# EAGLE design V5.8-18-09-27 (EAGLE 7.6.0)
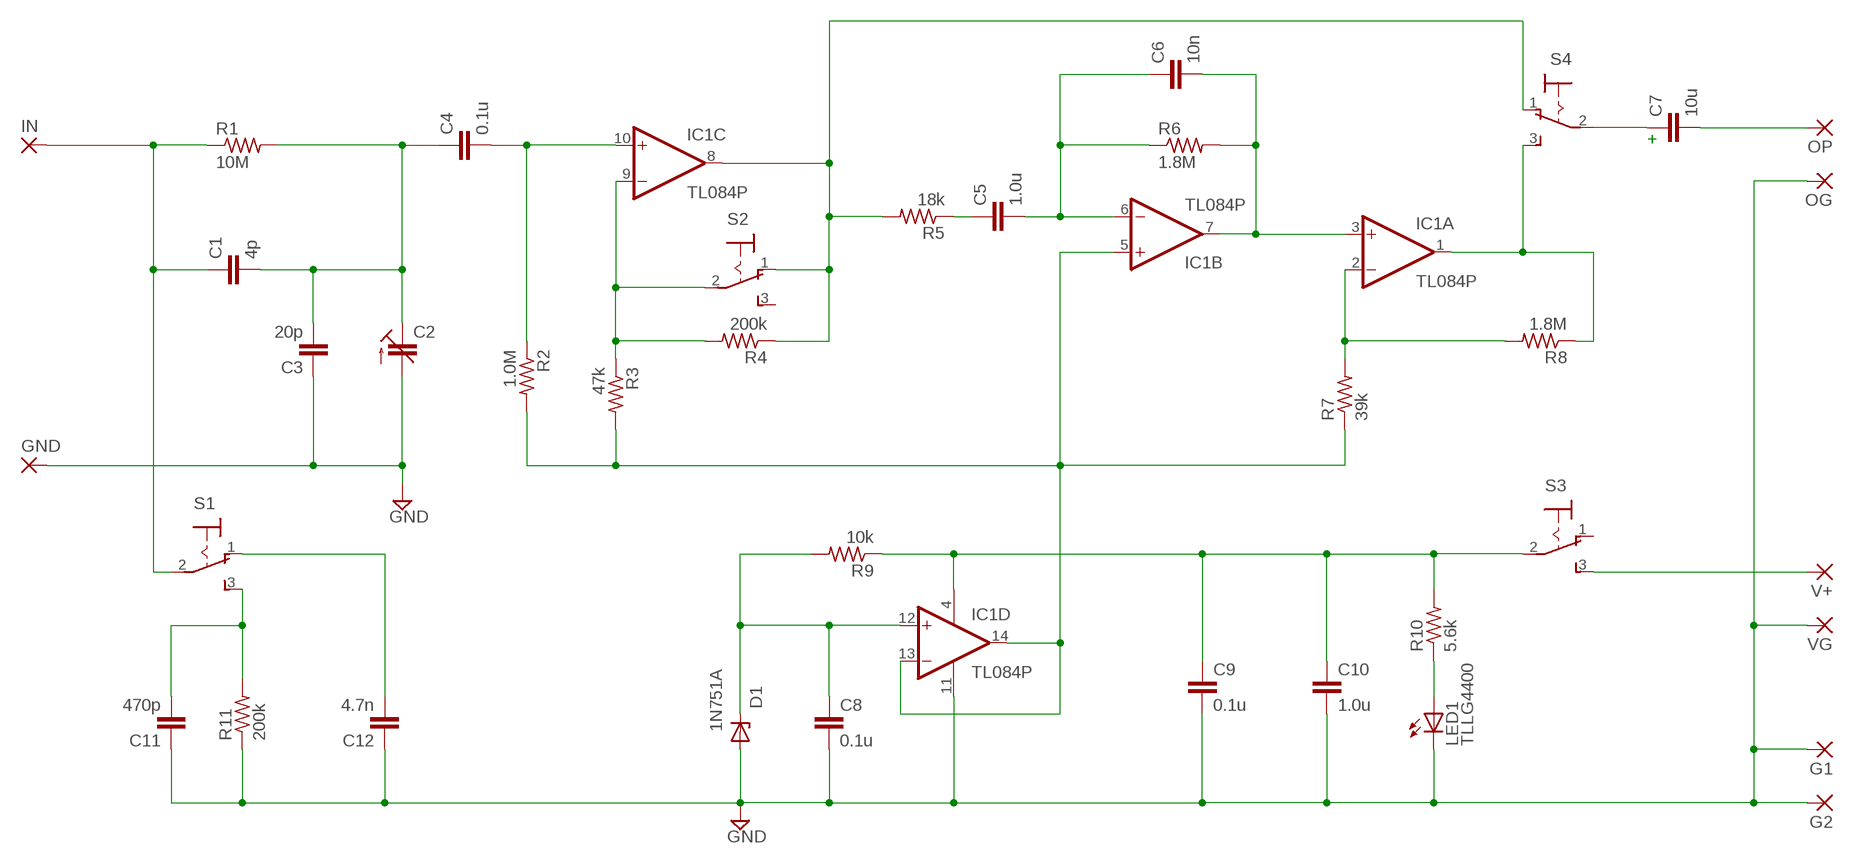
[diagram p0: schematic, sheet 1]

## Parts
C1  4p  C-EU050-024X044  [C050-024X044]
C2  C-TRIMMGKG20015  [GKG20015]
C3  20p  C-EU050-024X044  [C050-024X044]
C4  0.1u  C-EU050-024X044  [C050-024X044]
C5  1.0u  C-EU050-024X044  [C050-024X044]
C6  10n  C-EU050-024X044  [C050-024X044]
C7  10u  C-EU050-024X044  [C050-024X044]
C8  0.1u  C-EU050-024X044  [C050-024X044]
C9  0.1u  C-EU050-024X044  [C050-024X044]
C10  1.0u  C-EU050-024X044  [C050-024X044]
C11  470p  C-EU050-024X044  [C050-024X044]
C12  4.7n  C-EU050-024X044  [C050-024X044]
D1  ZENER-DIODEDO35Z10  [DO35Z10]
G1  2,54/1,1  [2,54/1,1]
G2  2,54/1,1  [2,54/1,1]
GND  2,54/1,1  [2,54/1,1]
IC1  TL084P  [DIL14]
IN  2,54/1,1  [2,54/1,1]
LED1  TLLG4400  [LED3MM]
OG  2,54/1,1  [2,54/1,1]
OP  2,54/1,1  [2,54/1,1]
R1  10M  R-US_0207/10  [0207/10]
R2  1.0M  R-US_0207/10  [0207/10]
R3  47k  R-US_0207/10  [0207/10]
R4  200k  R-US_0207/10  [0207/10]
R5  18k  R-US_0207/10  [0207/10]
R6  1.8M  R-US_0207/10  [0207/10]
R7  39k  R-US_0207/10  [0207/10]
R8  1.8M  R-US_0207/10  [0207/10]
R9  10k  R-US_0207/10  [0207/10]
R10  5.6k  R-US_0207/10  [0207/10]
R11  200k  R-US_0207/10  [0207/10]
S1  320-916  [320-916]
S2  320-916  [320-916]
S3  320-916  [320-916]
S4  320-916  [320-916]
V+  2,54/1,1  [2,54/1,1]
VG  2,54/1,1  [2,54/1,1]

## Nets
GND: C2.1(A) C3.1 C8.2 C9.2 C10.2 C11.1 C12.1 D1.A G1.1(P) G2.1(P) GND.1(P) IC1.11(P:V-) LED1.K(C) OG.1(P) R11.1 VG.1(P)
IT: C12.2 S1.1(O)
N$1: LED1.A R10.1
N$2: C5.1 R5.1
N$3: S3.3(S) V+.1(P)
N$4: IC1.8(C:OUT) R4.1 R5.2 S2.1(O) S4.1(O)
N$5: IC1.9(C:-IN) R3.1 R4.2 S2.2(P)
N$6: C6.2 IC1.3(A:+IN) IC1.7(B:OUT) R6.2
N$7: IC1.2(A:-IN) R7.2 R8.2
N$8: IC1.1(A:OUT) R8.1 S4.3(S)
N$9: C1.2 C2.2(E) C3.2 C4.1 R1.2
N$10: C8.1 D1.C IC1.12(D:+IN) R9.2
N$12: C4.2 IC1.10(C:+IN) R2.1
N$13: C1.1 IN.1(P) R1.1 S1.2(P)
N$14: IC1.5(B:+IN) IC1.13(D:-IN) IC1.14(D:OUT) R2.2 R3.2 R7.1
N$15: C9.1 C10.1 IC1.4(P:V+) R9.1 R10.2 S3.2(P)
N$16: C11.2 R11.2 S1.3(S)
N$17: C7.1 S4.2(P)
N$18: C5.2 C6.1 IC1.6(B:-IN) R6.1
N$22: C7.2 OP.1(P)
Unconnected: S2.3(S) S3.1(O)

## Notes on the sheet
- +

## Library data of the parts
C1 C3-C12 = resistor:C-EU: CAPACITOR, European symbol
C2 = rcl:C-TRIMM: Trimm capacitor
D1 = diode:ZENER-DIODE: Z-Diode
G1 G2 GND IN OG OP V+ VG = wirepad:2,54/1,1: THROUGH-HOLE PAD
IC1 = linear:TL084: OP AMP
LED1 = led:TLLG4400: Low Current (2mA) LED 3 mm Tinted Diffused Package color GREEN Source: Data sheet <http://www.farnell.com/datasheets/391098.pdf>; MF: VISHAY SEMICONDUCTOR; OC_FARNELL: 1612435
R1-R11 = resistor:R-US_: RESISTOR, American symbol
S1-S4 = switch:320-916: TOGGLE SWITCH distributor RS Components

## Board
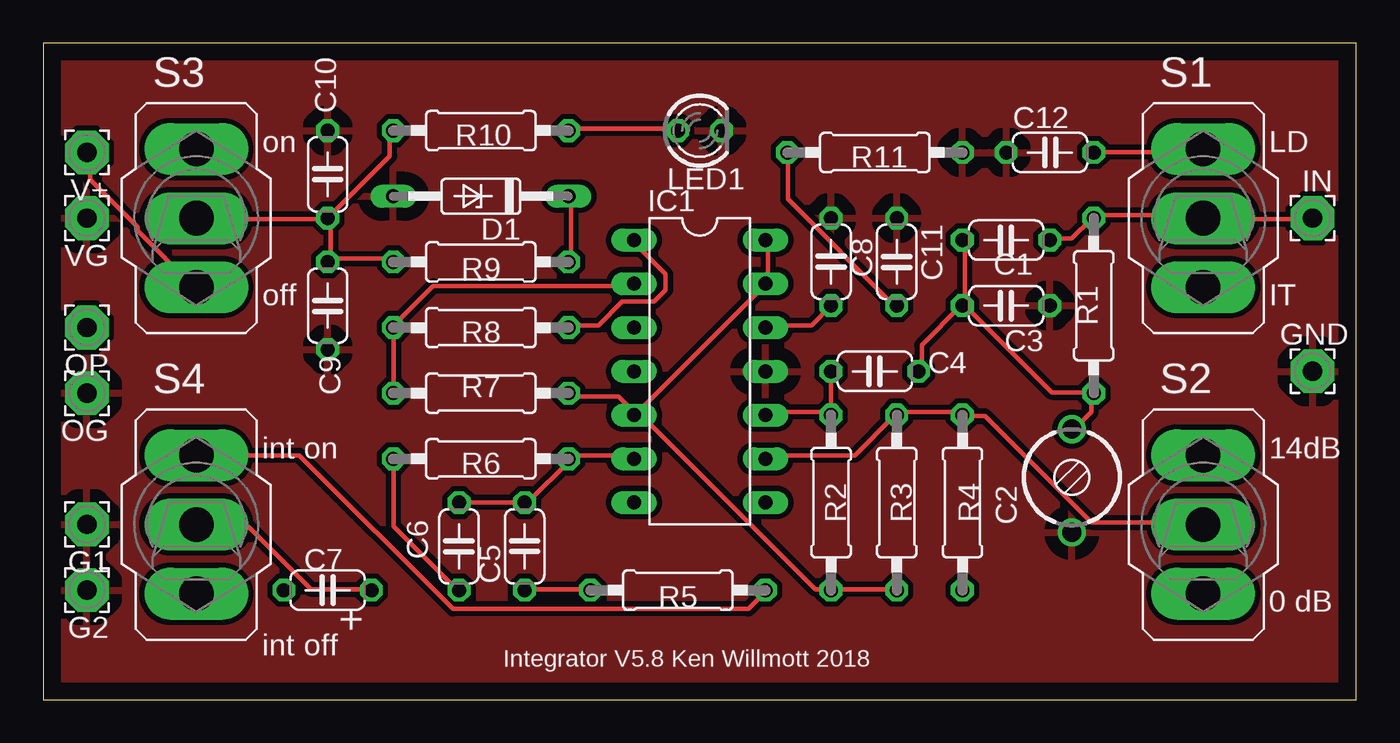
[diagram p1: board, top side]
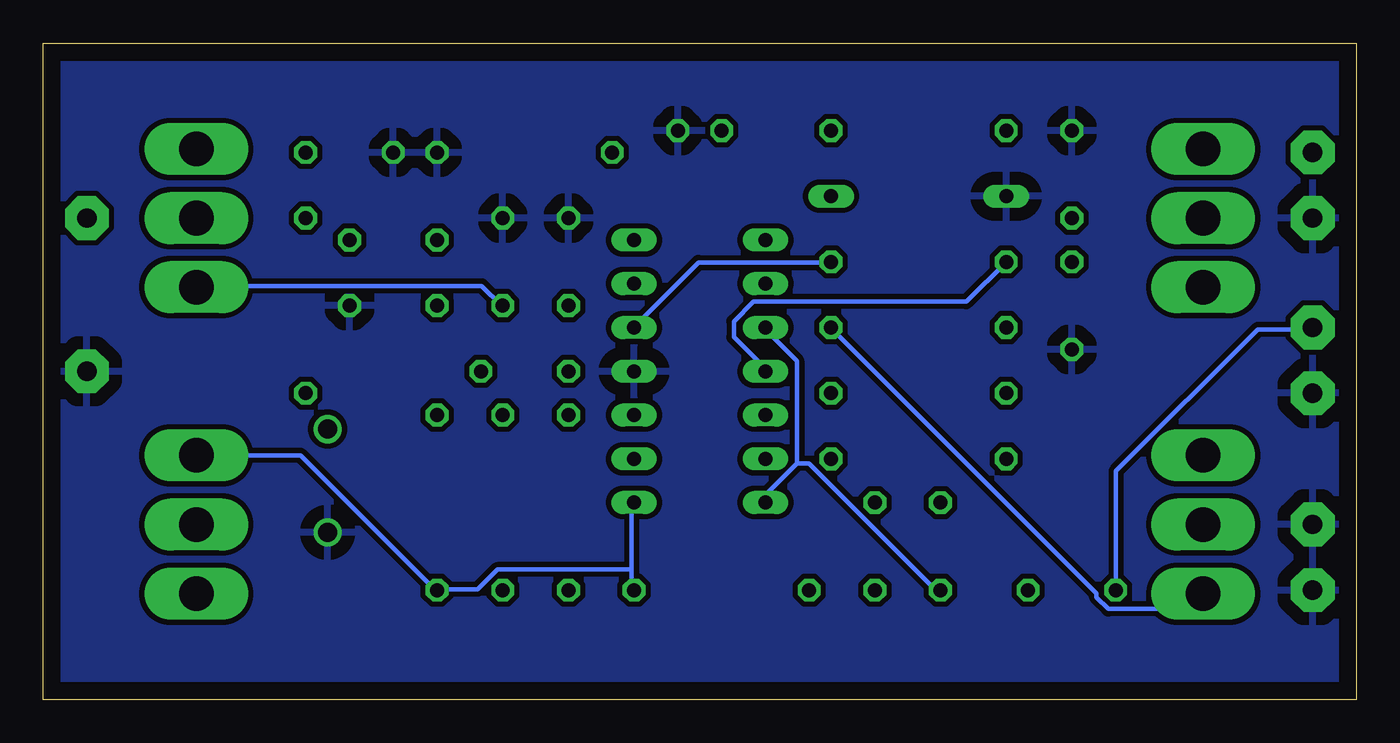
[diagram p2: board, bottom side, seen from below]

Size 76.2 x 38.1 mm. Coordinates in mm from the lower left corner, seen from the top.
Outline: 0,38.1 0,0 76.2,0 76.2,38.1 0,38.1
Copper layers (1*16): Top 0.035mm / dielectric 1.5mm / Bottom 0.035mm
Design rules "default *": minimum track width 10mil, minimum drill 24mil, track to track 8mil, track to pad 8mil, pad to pad 8mil, via to via 8mil, smd to smd 8mil, copper to edge 40mil, drill to drill 8mil, minimum pad ring 10mil, minimum via ring 8mil, stop-mask expansion 4mil, vias tented up to drill 0mil, thermal gap 30mil

### Footprints (pad centres in the part's own frame; a part is rotated, then mirrored left to right if it is on the bottom)
C050-024X044 = drill 0.813 octagon: 1 -2.54,0; 2 2.54,0
GKG20015 = drill 1.1: 1 -3,0; 2 3,0
DO35Z10 = drill 0.813 long: A 5.08,0; C -5.08,0
2,54/1,1 = drill 1.118 pad 2.54 octagon: 1 0,0
DIL14 = drill 0.813 long: 1 -7.62,-3.81; 2 -5.08,-3.81; 3 -2.54,-3.81; 4 0,-3.81; 5 2.54,-3.81; 6 5.08,-3.81; 7 7.62,-3.81; 8 7.62,3.81; 9 5.08,3.81; 10 2.54,3.81; 11 0,3.81; 12 -2.54,3.81; 13 -5.08,3.81; 14 -7.62,3.81
LED3MM = drill 0.813 octagon: A -1.27,0; K 1.27,0
0207/10 = drill 0.813 octagon: 1 -5.08,0; 2 5.08,0
320-916 = drill 2.007 long: 1 0,4.013; 2 0,0; 3 0,-4.013

### Placement (x,y rotation side)
C1  55.88,26.67 180 top
C2  59.69,12.7 90 top
C3  55.88,22.86 180 top
C4  48.26,19.05 180 top
C5  27.94,8.89 90 top
C6  24.13,8.89 270 top
C7  16.51,6.35 180 top
C8  45.72,25.4 90 top
C9  16.51,22.86 270 top
C10  16.51,30.48 90 top
C11  49.53,25.4 270 top
C12  58.42,31.75 0 top
D1  25.4,29.21 180 top
G1  2.54,10.16 180 top
G2  2.54,6.35 180 top
GND  73.66,19.05 0 top
IC1  38.1,19.05 270 top
IN  73.66,27.94 0 top
LED1  38.1,33.02 0 top
OG  2.54,17.78 180 top
OP  2.54,21.59 180 top
R1  60.96,22.86 270 top
R2  45.72,11.43 270 top
R3  49.53,11.43 270 top
R4  53.34,11.43 90 top
R5  36.83,6.35 0 top
R6  25.4,13.97 180 top
R7  25.4,17.78 180 top
R8  25.4,21.59 180 top
R9  25.4,25.4 0 top
R10  25.4,33.02 180 top
R11  48.26,31.75 180 top
S1  67.31,27.94 0 top
S2  67.31,10.16 0 top
S3  8.89,27.94 0 top
S4  8.89,10.16 0 top
V+  2.54,31.75 180 top
VG  2.54,27.94 180 top

### Tracks (layer width: path | path; a pad name or v marks a point on that pad's centre or on a via)
GND
  pour Bottom (isolate 0.305): 0,0 0,38.1 76.2,38.1 76.2,0
  pour Top (isolate 0.305): 0,0 0,38.1 76.2,38.1 76.2,0
IT
  Top 0.254: C12.2 61.04,31.77 67.21,31.77 S1.1
N$1
  Top 0.254: R10.1 30.63,33.15 36.8,33.15 LED1.A
N$2
  Top 0.254: C5.1 28.12,6.4 31.55,6.4 R5.1
N$3
  Top 0.254: V+.1 2.74,31.55 2.74,30.18 5.49,27.43 5.49,27.2 8.69,24 S3.3
N$4
  Top 0.254: S4.1 14.86,14.17 23.77,5.26 40.92,5.26 41.83,6.17 R5.2
  Bottom 0.254: 42.06,7.54 42.06,11.43 IC1.8 | 42.06,7.54 42.06,6.4 R5.2 | 42.06,7.54 49.84,7.54 50.98,6.4 53.26,6.4 R4.1 53.49,6.4 61.27,14.17 S2.1
N$5
  Top 0.254: IC1.9 42.06,14.17 47.09,14.17 49.38,16.46 R3.1 49.61,16.69 53.26,16.69 R4.2 53.49,16.46 54.63,16.46 60.81,10.29 67.21,10.29 S2.2
N$6
  Top 0.254: R6.2 20.34,13.95 20.34,10.06 24,6.4 C6.2
  Bottom 0.254: IC1.7 34.29,11.89 32.46,13.72 | 32.46,13.72 32.46,19.66 34.29,21.49 IC1.3 | 32.46,13.72 31.77,13.72 24.23,6.17 C6.2
N$7
  Top 0.254: R7.2 20.34,17.83 20.34,21.49 R8.2 20.34,21.72 22.63,24 34.29,24 IC1.2
N$8
  Top 0.254: R8.1 30.63,21.72 32.23,21.72 33.6,23.09 35.43,23.09 36.12,23.77 36.12,24.69 34.29,26.52 IC1.1
  Bottom 0.254: R8.1 30.4,21.49 15.09,6.17 15.09,5.94 14.4,5.26 9.6,5.26 8.91,5.94 S4.3
N$9
  Top 0.254: C2.2 59.89,15.77 60.81,16.69 60.81,17.6 R1.2 60.81,17.83 58.52,17.83 53.49,22.86 | C4.1 50.98,19.2 50.98,20.57 53.26,22.86 C3.2 53.49,22.86 | 53.49,22.86 53.49,26.52 C1.2
N$10
  Top 0.254: R9.2 30.63,25.6 30.63,29.03 D1.C | C8.1 44.58,21.72 42.06,21.72 IC1.12
  Bottom 0.254: R9.2 30.63,25.38 38.18,25.38 41.83,21.72 IC1.12
N$12
  Top 0.254: 45.72,16.69 42.06,16.69 IC1.10 | 45.72,16.69 C4.2 | 45.72,16.69 R2.1
N$13
  Top 0.254: C1.1 58.52,26.75 59.66,26.75 60.81,27.89 R1.1 61.04,28.12 67.21,28.12 S1.2 67.44,27.89 73.61,27.89 IN.1
N$14
  Top 0.254: 45.72,6.4 49.38,6.4 R3.2 | IC1.14 42.06,26.52 42.06,24.23 IC1.13 41.83,24 34.52,16.69 | R7.1 30.63,17.6 33.38,17.6 34.29,16.69 IC1.5 | 34.52,16.69 34.29,16.46 IC1.5 | 45.72,6.4 44.81,6.4 34.52,16.69 | 45.72,6.4 R2.2 | 34.52,16.69 IC1.5
N$15
  Top 0.254: 16.69,25.6 16.69,27.89 C10.1 | 16.69,25.6 20.12,25.6 R9.1 | 16.69,25.6 C9.1 | C10.1 20.12,31.55 20.12,32.92 R10.2 | S3.2 8.91,27.89 16.46,27.89 C10.1
  Bottom 0.254: R9.1 22.63,23.09 34.98,23.09 36.12,21.95 36.12,21.03 34.29,19.2 IC1.4
N$16
  Top 0.254: R11.2 43.2,31.55 43.2,29.03 49.38,22.86 C11.2
  Bottom 0.254: S1.3 67.21,24 50.75,24 49.61,22.86 C11.2
N$17
  Top 0.254: C7.1 18.97,6.4 15.54,6.4 11.89,10.06 8.91,10.06 S4.2
N$18
  Top 0.254: C6.1 C5.2 28.12,11.43 30.63,13.95 R6.1 30.63,14.17 34.29,14.17 IC1.6
N$22
  Bottom 0.254: C7.2 13.95,6.4 13.95,13.26 5.71,21.49 2.74,21.49 OP.1

### Text on the board
tNames: on | LD | off | IT | int on | 14dB | 0 dB | + | int off | Integrator V5.8 Ken Willmott 2018